# Altium project MLAB_Hazi.PrjPcb
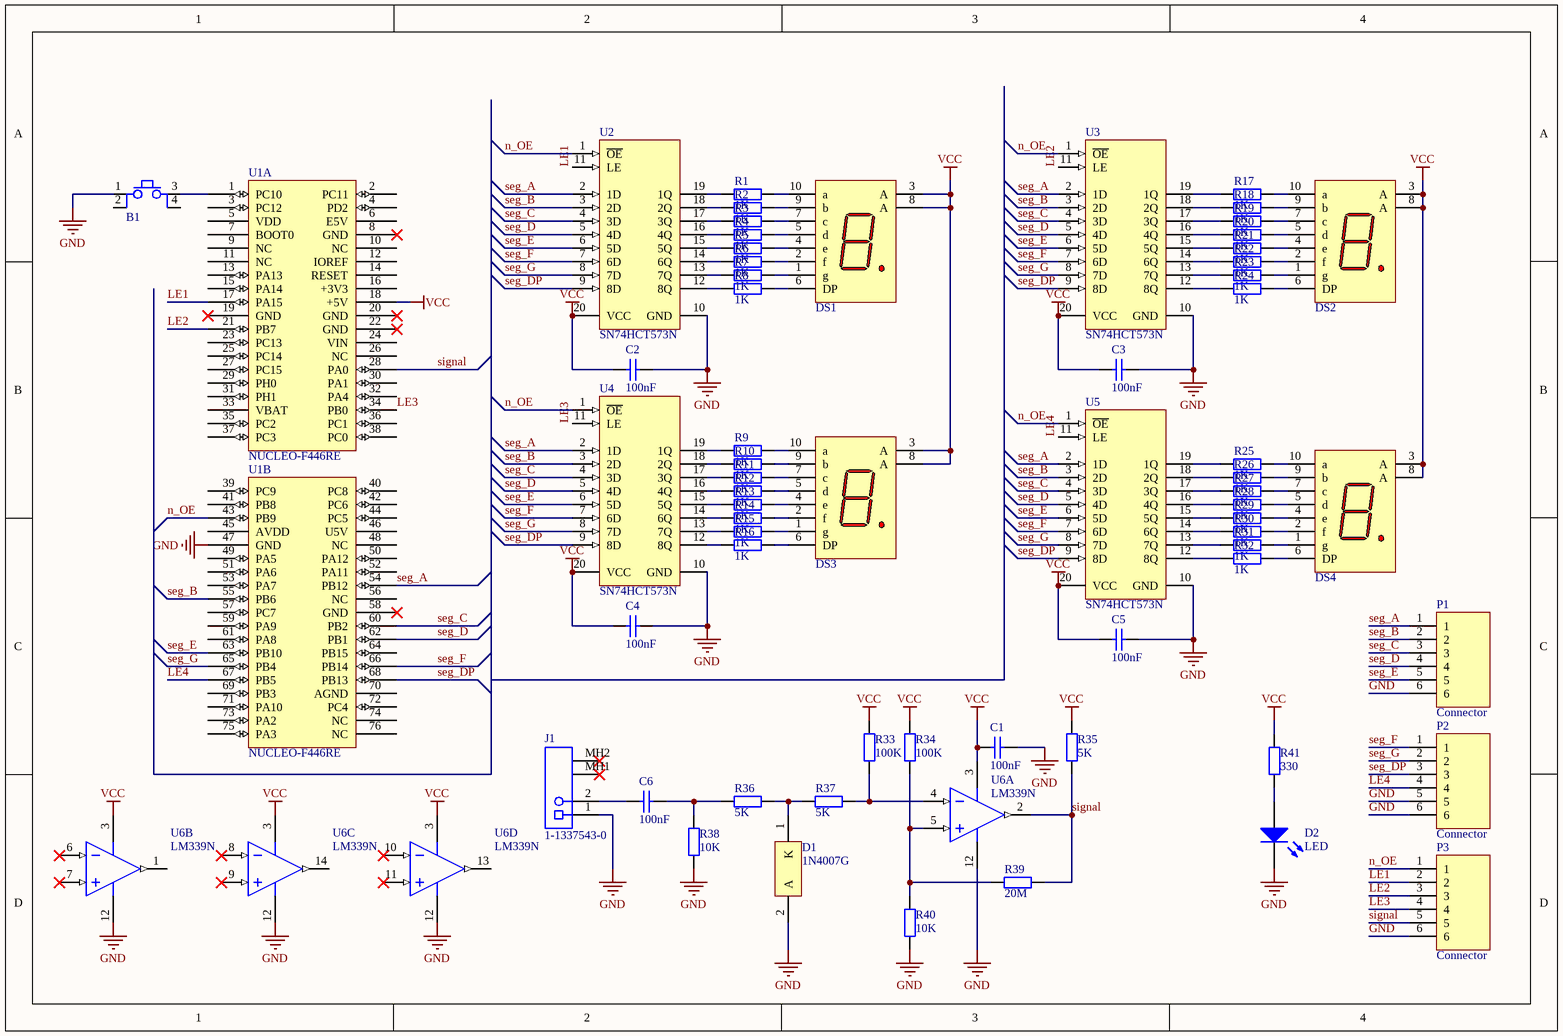
[diagram p0: Nucleo.SchDoc]
1 sheet, 64 parts. Net scope: global (net labels, ports and power ports of the same name join across sheets).
Board file: hazi_kiindulas.PcbDoc

## Sheet Nucleo.SchDoc
size A4; Organization: BME AUT; Address1: Magyar tudósok krt. 2.; Address2: Q épület; Address3: Budapest; Address4: H-1117; DocumentNumber: 1; SheetNumber: 1; SheetTotal: 2

### Parts
B1  Button  [FP_BTN_SMD]  (value not drawn)
C1  100nF  [FP_0805_CAP_085]
C2  100nF  [FP_0805_CAP_085]
C3  100nF  [FP_0805_CAP_085]
C4  100nF  [FP_0805_CAP_085]
C5  100nF  [FP_0805_CAP_085]
C6  100nF  [FP_0805_CAP_085]
D1  1N4007G  [ONSC-AXIAL_LEAD-2-59-10_P]
D2  LED  [FP_0805_LED_RED]
DS1  7SEG  [FP_7SEG]  (value not drawn)
DS2  7SEG  [FP_7SEG]  (value not drawn)
DS3  7SEG  [FP_7SEG]  (value not drawn)
DS4  7SEG  [FP_7SEG]  (value not drawn)
J1  1-1337543-0  [TECO-1-1337543-0_V]
P1  Connector  [FP_CONN6_TAP_254MM]
P2  Connector  [FP_CONN6_TAP_254MM]
P3  Connector  [FP_CONN6_TAP_254MM]
R1  1K  [FP_0603_RES]
R2  1K  [FP_0603_RES]
R3  1K  [FP_0603_RES]
R4  1K  [FP_0603_RES]
R5  1K  [FP_0603_RES]
R6  1K  [FP_0603_RES]
R7  1K  [FP_0603_RES]
R8  1K  [FP_0603_RES]
R9  1K  [FP_0603_RES]
R10  1K  [FP_0603_RES]
R11  1K  [FP_0603_RES]
R12  1K  [FP_0603_RES]
R13  1K  [FP_0603_RES]
R14  1K  [FP_0603_RES]
R15  1K  [FP_0603_RES]
R16  1K  [FP_0603_RES]
R17  1K  [FP_0603_RES]
R18  1K  [FP_0603_RES]
R19  1K  [FP_0603_RES]
R20  1K  [FP_0603_RES]
R21  1K  [FP_0603_RES]
R22  1K  [FP_0603_RES]
R23  1K  [FP_0603_RES]
R24  1K  [FP_0603_RES]
R25  1K  [FP_0603_RES]
R26  1K  [FP_0603_RES]
R27  1K  [FP_0603_RES]
R28  1K  [FP_0603_RES]
R29  1K  [FP_0603_RES]
R30  1K  [FP_0603_RES]
R31  1K  [FP_0603_RES]
R32  1K  [FP_0603_RES]
R33  100K  [FP_0603_RES]
R34  100K  [FP_0603_RES]
R35  5K  [FP_0603_RES]
R36  5K  [FP_0603_RES]
R37  5K  [FP_0603_RES]
R38  10K  [FP_0603_RES]
R39  20M  [FP_0603_RES]
R40  10K  [FP_0603_RES]
R41  330  [FP_0603_RES]
U1  NUCLEO-F446RE  [FP_NUCLEO-64]  (parts A,B of 2)
U2  SN74HCT573N  [N0020A]
U3  SN74HCT573N  [N0020A]
U4  SN74HCT573N  [N0020A]
U5  SN74HCT573N  [N0020A]
U6  LM339N  [N0014A]  (parts A,B,C,D of 4)

### Nets
GND: B1.1 C1.2 C2.1 C3.1 C4.1 C5.1 D1.2(A) D2.2(K) J1.1 P1.6 P2.5 P2.6 P3.6 R38.1 R40.2 U1.47(GND) U2.10(GND) U3.10(GND) U4.10(GND) U5.10(GND) U6.12(GND)
VCC: C1.1 C2.2 C3.2 C4.2 C5.2 DS1.3(A) DS1.8(A) DS2.3(A) DS2.8(A) DS3.3(A) DS3.8(A) DS4.3(A) DS4.8(A) R33.1 R34.1 R35.2 R41.2 U1.18(+5V) U2.20(VCC) U3.20(VCC) U4.20(VCC) U5.20(VCC) U6.3(V+)
LE1: P3.2 U1.17(PA15) U2.11(LE)
LE2: P3.3 U1.21(PB7) U3.11(LE)
LE3: P3.4 U1.34(PB0) U4.11(LE)
LE4: P2.4 U1.67(PB5) U5.11(LE)
n_OE: P3.1 U1.43(PB9) U2.1(~{OE}) U3.1(~{OE}) U4.1(~{OE}) U5.1(~{OE})
seg_A: P1.1 U1.54(PB12) U2.2(1D) U3.2(1D) U4.2(1D) U5.2(1D)
seg_B: P1.2 U1.55(PB6) U2.3(2D) U3.3(2D) U4.3(2D) U5.3(2D)
seg_C: P1.3 U1.60(PB2) U2.4(3D) U3.4(3D) U4.4(3D) U5.4(3D)
seg_D: P1.4 U1.62(PB1) U2.5(4D) U3.5(4D) U4.5(4D) U5.5(4D)
seg_DP: P2.3 U1.68(PB13) U2.9(8D) U3.9(8D) U4.9(8D) U5.9(8D)
seg_E: P1.5 U1.63(PB10) U2.6(5D) U3.6(5D) U4.6(5D) U5.6(5D)
seg_F: P2.1 U1.66(PB14) U2.7(6D) U3.7(6D) U4.7(6D) U5.7(6D)
seg_G: P2.2 U1.65(PB4) U2.8(7D) U3.8(7D) U4.8(7D) U5.8(7D)
signal: P3.5 R35.1 R39.2 U1.28(PA0) U6.2(OUT1)
NetB1_3: B1.3 U1.1(PC10)
NetC6_1: C6.1 J1.2
NetC6_2: C6.2 R36.2 R38.2
NetD1_1: D1.1(K) R36.1 R37.2
NetD2_1: D2.1(A) R41.1
NetDS1_1: DS1.1(g) R7.2
NetDS1_2: DS1.2(f) R6.2
NetDS1_4: DS1.4(e) R5.2
NetDS1_5: DS1.5(d) R4.2
NetDS1_6: DS1.6(DP) R8.2
NetDS1_7: DS1.7(c) R3.2
NetDS1_9: DS1.9(b) R2.2
NetDS1_10: DS1.10(a) R1.2
NetDS2_1: DS2.1(g) R23.2
NetDS2_2: DS2.2(f) R22.2
NetDS2_4: DS2.4(e) R21.2
NetDS2_5: DS2.5(d) R20.2
NetDS2_6: DS2.6(DP) R24.2
NetDS2_7: DS2.7(c) R19.2
NetDS2_9: DS2.9(b) R18.2
NetDS2_10: DS2.10(a) R17.2
NetDS3_1: DS3.1(g) R15.2
NetDS3_2: DS3.2(f) R14.2
NetDS3_4: DS3.4(e) R13.2
NetDS3_5: DS3.5(d) R12.2
NetDS3_6: DS3.6(DP) R16.2
NetDS3_7: DS3.7(c) R11.2
NetDS3_9: DS3.9(b) R10.2
NetDS3_10: DS3.10(a) R9.2
NetDS4_1: DS4.1(g) R31.2
NetDS4_2: DS4.2(f) R30.2
NetDS4_4: DS4.4(e) R29.2
NetDS4_5: DS4.5(d) R28.2
NetDS4_6: DS4.6(DP) R32.2
NetDS4_7: DS4.7(c) R27.2
NetDS4_9: DS4.9(b) R26.2
NetDS4_10: DS4.10(a) R25.2
NetR1_1: R1.1 U2.19(1Q)
NetR2_1: R2.1 U2.18(2Q)
NetR3_1: R3.1 U2.17(3Q)
NetR4_1: R4.1 U2.16(4Q)
NetR5_1: R5.1 U2.15(5Q)
NetR6_1: R6.1 U2.14(6Q)
NetR7_1: R7.1 U2.13(7Q)
NetR8_1: R8.1 U2.12(8Q)
NetR9_1: R9.1 U4.19(1Q)
NetR10_1: R10.1 U4.18(2Q)
NetR11_1: R11.1 U4.17(3Q)
NetR12_1: R12.1 U4.16(4Q)
NetR13_1: R13.1 U4.15(5Q)
NetR14_1: R14.1 U4.14(6Q)
NetR15_1: R15.1 U4.13(7Q)
NetR16_1: R16.1 U4.12(8Q)
NetR17_1: R17.1 U3.19(1Q)
NetR18_1: R18.1 U3.18(2Q)
NetR19_1: R19.1 U3.17(3Q)
NetR20_1: R20.1 U3.16(4Q)
NetR21_1: R21.1 U3.15(5Q)
NetR22_1: R22.1 U3.14(6Q)
NetR23_1: R23.1 U3.13(7Q)
NetR24_1: R24.1 U3.12(8Q)
NetR25_1: R25.1 U5.19(1Q)
NetR26_1: R26.1 U5.18(2Q)
NetR27_1: R27.1 U5.17(3Q)
NetR28_1: R28.1 U5.16(4Q)
NetR29_1: R29.1 U5.15(5Q)
NetR30_1: R30.1 U5.14(6Q)
NetR31_1: R31.1 U5.13(7Q)
NetR32_1: R32.1 U5.12(8Q)
NetR33_2: R33.2 R37.1 U6.4(IN1-)
NetR34_2: R34.2 R39.1 R40.1 U6.5(IN1+)

Not connected (* = marked no-connect by the designer): B1 2 4; J1 MH1* MH2*; U1 2(PC11) 3(PC12) 4(PD2) 5(VDD) 6(E5V) 7(BOOT0) 8(GND)* 9(NC) 10(NC) 11(NC) 12(IOREF) 13(PA13) 14(RESET) 15(PA14) 16(+3V3) 19(GND)* 20(GND)* 22(GND)* 23(PC13) 24(VIN) 25(PC14) 26(NC) 27(PC15) 29(PH0) 30(PA1) 31(PH1) 32(PA4) 33(VBAT) 35(PC2) 36(PC1) 37(PC3) 38(PC0) 39(PC9) 40(PC8) 41(PB8) 42(PC6) 44(PC5) 45(AVDD) 46(U5V) 48(NC) 49(PA5) 50(PA12) 51(PA6) 52(PA11) 53(PA7) 56(NC) 57(PC7) 58(GND)* 59(PA9) 61(PA8) 64(PB15) 69(PB3) 70(AGND) 71(PA10) 72(PC4) 73(PA2) 74(NC) 75(PA3) 76(NC); U6 1(OUT2) 6(IN2-)* 7(IN2+)* 8(IN3-)* 9(IN3+)* 10(IN4-)* 11(IN4+)* 13(OUT4) 14(OUT3)

### Notes on the sheet
- Title
- Size:
- Date:
- A4
- Number:
- Time:
- Revision:
- Sheet
- of
- File:

### Library data of the parts
B1 = Button 4P: Push button; Name: TACT 6x 6 4P SPST 2 FSM4JSMA (TYC) 50mA 12VDC SMD H=5mm 160g BLACK B. 4-1437565-1; Reference: 45-05-43; Supplier: Lomex
C1-C6 = CAP: Capacitor; Name: 100nF 0805 10% 50V X7R 0805B104K500CT (WAL); Supplier: Lomex; Reference: 82-10-76; Value: 100nF
D1 = CMP-0902-00143-1: Standard Recovery Rectifier, 2-Pin Axial_Lead, Pb-Free, Bulk Bag; Manufacturer: On Semiconductor; VRRM Max (V): 1000; IFSM Max (A): 30; IO(rec) Max (A): 1; Name: 0.15A 100V SWITCH 1N4148TR (VIS) trr<4nsec DO-35; ComponentLink2Description: Datasheet; ComponentLink2URL: http://www.onsemi.com/pub_link/Collateral/1N4001-D.PDF; PackageDescription: 2-Pin, Axial Lead, Diameter 2.35 mm; PartNumber: 1N4007G; ComponentLink1URL: http://www.onsemi.com/; ComponentLink3URL: http://www.onsemi.cn/pub_link/Collateral/59-10.PDF; PackageReference: AXIAL_LEAD-2-59-10; ComponentLink1Description: Manufacturer URL; Mounting Technology: Through Hole; ComponentLink3Description: Package Specification; Packing: Bulk Bag; PackageVersion: Rev. U, 02/2005; DatasheetVersion: Rev. 13; RoHS: TRUE; Type: Standard Recovery; Supplier: Lomex; Reference: 16-01-04
D2 = LED: Typical RED GaAs LED; pin to pad: 1>A 2>K; Name: 2012 GREEN 565nm 12mcd KP-2012SGD (KIN) GRE.DIFF. 2x1.2x1.1mm 0805 120°; Supplier: Lomex; Reference: 95-00-21
DS1-DS4 = 7SEG: Common Anode 7 Segment Display; Name: FYS-3911BUHR-21 (FYL) 7 SEG SRED COM.AN.; Reference: 35-03-94; Supplier: Lomex
J1 = CMP-2000-05853-1: Female Connector, Pitch 2.54 mm, 1 x 2 Position, Height 15.8 mm, Tail Length 3.8 mm, / -55 to 85 degC, RoHS, Bulk; Manufacturer: TE Connectivity; Connector Body Style: RightAngleJack; Frequency Max: 4GHz; Coaxial Termination: Solder; Connector Mounting: PCBMount; SVHC: ToBeAdvised; Connector Type: BNCCoaxial; Impedance: 50ohm; Name: BNC 1 P ANYA 90° BNC-S07HP (T-T) H-F 15.8mm 50R NYÁK 90° SZIGETELT CSAVAR NÉLKÜL !!; Coaxial Cable Types: -; Manufacturer URL: http://www.te.com/; Package Reference: 1-1337543-0; Product Range: -; Datasheet URL: http://www.te.com/commerce/DocumentDelivery/DDEController?Action=showdoc&DocId=Customer+Drawing%7F1337543%7FG%7Fpdf%7FEnglish%7FENG_CD_1337543_G.pdf%7F1-1337543-0; Contact Plating: GoldPlatedContacts; Mounting Technology: ThroughHole; Package Description: Female Connector, Pitch 2.54 mm, 1 x 2 Position, Height 15.8 mm, Tail Length 3.8 mm; Contact Material: Brass; Datasheet Version: Rev. G, 12/2012; Reference: 43-15-22; Supplier: Lomex
P1-P3 = Connector_6pin: 6pin connector
R1-R32 = RES: Resistor; Name: 1K00 0603 5% WR06X102JTL 0.1W (WAL); Supplier: Lomex; Reference: 81-27-92; Value: 1K
R33 R34 = RES: Resistor; Name: 100K 0603 5% RC0603JR-10100KL 0.1W (YAG); Supplier: Lomex; Reference: 81-34-88; Value: 100K
R35-R37 = RES: Resistor; Name: 5K10 0603 5% WR06X512JTL 0.1W (WAL); Supplier: Lomex; Reference: 81-28-96; Value: 5K
R38 R40 = RES: Resistor; Name: 10K0 0603 5% WR06X103JTL 0.1W (WAL); Supplier: Lomex; Reference: 81-29-03; Value: 10K
R39 = RES: Resistor; Name: 20M0 0603 5% RC0603JR-0720ML 0.1W (YAG); Supplier: Lomex; Reference: 81-27-41; Value: 20M
R41 = RES: Resistor; Name: 330R 0603 5% WR06X331JTL 0.1W (WAL); Supplier: Lomex; Reference: 81-17-48; Value: 330
U1 = NUCLEO-F446RE: Reference: NUCLEO; Name: Nucleo F446RE; Supplier: Tanszék
U2-U5 = CMP-1621-00374-2: Octal Transparent D-Type Latches With 3-State Outputs, N0020A, TUBE; Manufacturer: Texas Instruments; Output Type: CMOS; 3-State Output: Yes; Output Drive (IOL/IOH)(Max)(mA): 6/-6; VCC(Max)(V): 5.5; Bits(#): 8; F @ Nom Voltage(Max)(Mhz): 25; Output Logic: Non-inverted; Voltage(Nom)(V): 5; Static Current: 0.08; Logic: True; Input Type: TTL; Technology Family: HCT; tpd @ Nom Voltage(Max)(ns): 40; Rating: Catalog; VCC(Min)(V): 4.5; Schmitt Trigger: No; Name: SN74HCT573N (TI) 8xD-TYPE TRANSPARENT LATCH 3-STATE OUTPUT DIP-20; Operating Temperature Range(C): -40 to 85; Generic Part Number: SN74HCT573; ICC @ Nom Voltage(Max)(mA): 0.08; DatasheetVersion: SCLS176E; Code_JEDEC: MS-001; PackageReference: N0020A; Reference: 30-09-06; Supplier: Lomex
U6 = CMP-0055-00143-3: Low Power Low Offset Voltage Quad Comparator, 14-pin MDIP; Manufacturer: Texas Instruments; CompType: Amplifiers; PackageTopMarking: NSUZXYYTTE#*LM339N; PowerWise: N; Name: LM339N (TI) 4xVOLTAGE COMPARATOR DIP-14; Code_JEDEC: MS-001-AA; ComponentLink1URL: http://www.ti.com/general/docs/lit/getliterature.tsp?genericPartNumber=LM339&fileType=pdf; Package Reference: N0014A; ComponentLink1Description: Datasheet URL; RoHS: N; PinCount: 14; PackageDescription: MDIP, .750 x .250 x.130in, 14 Lead, .100in Pitch; Reference: 32-17-66; Supplier: Lomex